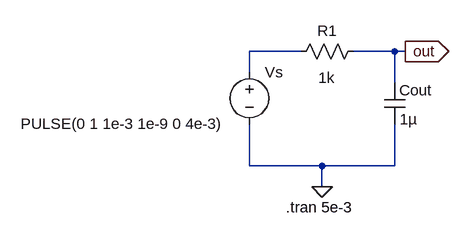
[diagram p0: schematic esercitazione1.asc]
esercitazione1.asc, the LTspice schematic file:
Version 4
SHEET 1 880 680
WIRE 240 -128 160 -128
WIRE 384 -128 320 -128
WIRE 400 -128 384 -128
WIRE 160 -96 160 -128
WIRE 384 -80 384 -128
WIRE 160 48 160 -16
WIRE 272 48 160 48
WIRE 384 48 384 -16
WIRE 384 48 272 48
WIRE 272 80 272 48
FLAG 272 80 0
FLAG 400 -128 out
IOPIN 400 -128 Out
SYMBOL res 336 -144 R90
WINDOW 0 0 56 VBottom 2
WINDOW 3 41 57 VTop 2
SYMATTR InstName R1
SYMATTR Value 1k
SYMBOL cap 368 -80 R0
WINDOW 0 23 12 Left 2
SYMATTR InstName Cout
SYMATTR Value 1µ
SYMBOL voltage 160 -112 R0
WINDOW 3 -352 95 Left 2
WINDOW 123 0 0 Left 0
WINDOW 39 0 0 Left 0
SYMATTR InstName Vs
SYMATTR Value PULSE(0 1 1e-3 1e-9 0 4e-3)
TEXT 216 112 Left 2 !.tran 5e-3

The netlist it stands for:
* esercitazione1.asc
R1 out N001 1k
Cout out 0 1µ
Vs N001 0 PULSE(0 1 1e-3 1e-9 0 4e-3)
.tran 5e-3
.backanno
.end